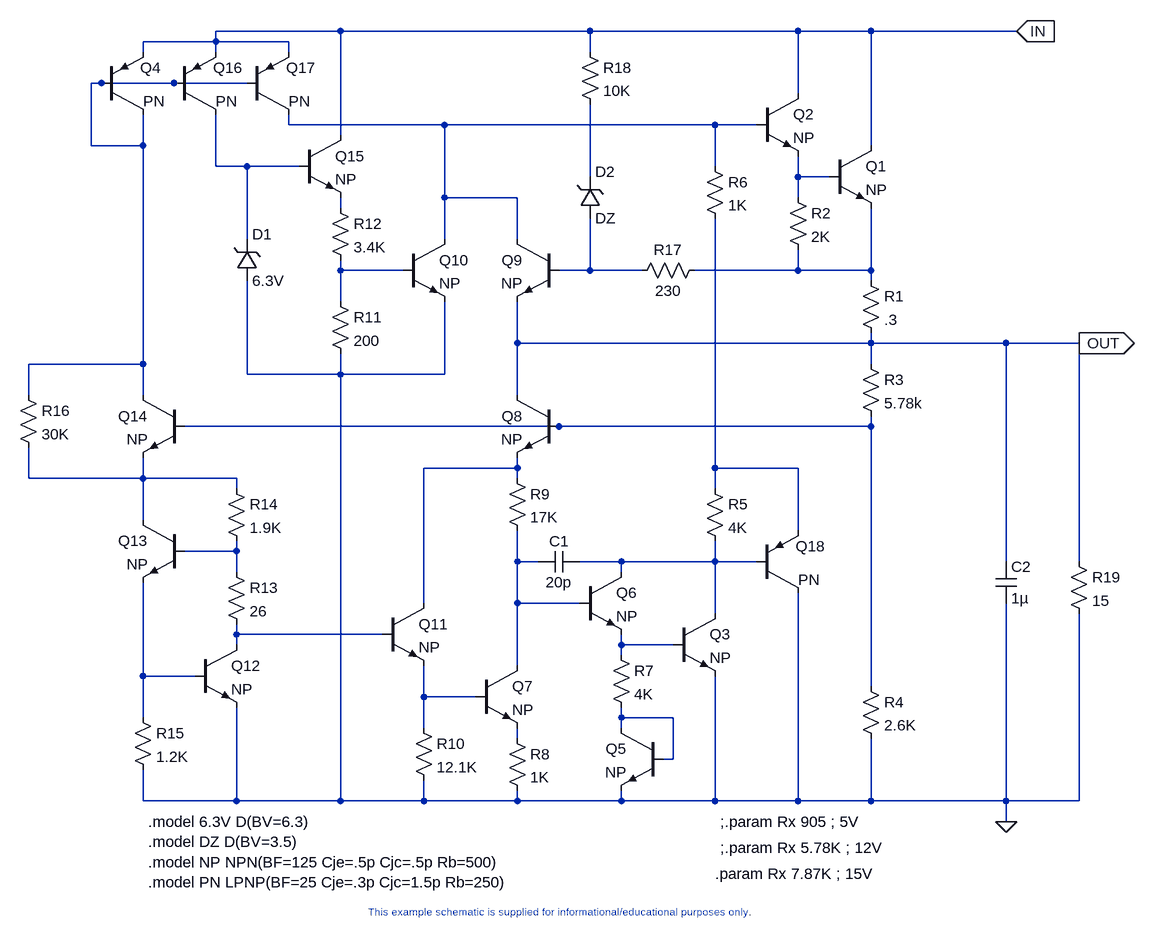
[diagram p0: schematic LM78XX.asc]
LM78XX.asc, the LTspice schematic file:
Version 4
SHEET 1 2428 1688
WIRE 1120 288 928 288
WIRE 1504 288 1120 288
WIRE 1824 288 1504 288
WIRE 1936 288 1824 288
WIRE 2160 288 1936 288
WIRE 928 304 928 288
WIRE 928 304 816 304
WIRE 1040 304 928 304
WIRE 816 320 816 304
WIRE 928 320 928 304
WIRE 1040 320 1040 304
WIRE 1504 320 1504 288
WIRE 752 368 736 368
WIRE 864 368 752 368
WIRE 976 368 864 368
WIRE 1824 384 1824 288
WIRE 1040 432 1040 416
WIRE 1280 432 1040 432
WIRE 1696 432 1280 432
WIRE 1760 432 1696 432
WIRE 1120 448 1120 288
WIRE 736 464 736 368
WIRE 816 464 816 416
WIRE 816 464 736 464
WIRE 1936 464 1936 288
WIRE 928 496 928 416
WIRE 976 496 928 496
WIRE 1056 496 976 496
WIRE 1696 496 1696 432
WIRE 1504 512 1504 400
WIRE 1824 512 1824 480
WIRE 1872 512 1824 512
WIRE 1280 544 1280 432
WIRE 1392 544 1280 544
WIRE 1824 544 1824 512
WIRE 1120 560 1120 544
WIRE 976 608 976 496
WIRE 1280 608 1280 544
WIRE 1392 608 1392 544
WIRE 1120 656 1120 640
WIRE 1216 656 1120 656
WIRE 1504 656 1504 576
WIRE 1504 656 1456 656
WIRE 1584 656 1504 656
WIRE 1824 656 1824 624
WIRE 1824 656 1664 656
WIRE 1936 656 1936 560
WIRE 1936 656 1824 656
WIRE 1936 672 1936 656
WIRE 1120 704 1120 656
WIRE 1392 768 1392 704
WIRE 1936 768 1936 752
WIRE 1936 768 1392 768
WIRE 2144 768 1936 768
WIRE 2256 768 2144 768
WIRE 816 800 816 464
WIRE 816 800 640 800
WIRE 1936 800 1936 768
WIRE 976 816 976 672
WIRE 1120 816 1120 784
WIRE 1120 816 976 816
WIRE 1280 816 1280 704
WIRE 1280 816 1120 816
WIRE 640 848 640 800
WIRE 816 848 816 800
WIRE 1392 848 1392 768
WIRE 1456 896 880 896
WIRE 1936 896 1936 880
WIRE 1936 896 1456 896
WIRE 1392 960 1392 944
WIRE 1392 960 1248 960
WIRE 1696 960 1696 576
WIRE 1824 960 1696 960
WIRE 640 976 640 928
WIRE 816 976 816 944
WIRE 816 976 640 976
WIRE 960 976 816 976
WIRE 1392 976 1392 960
WIRE 960 992 960 976
WIRE 1696 992 1696 960
WIRE 816 1040 816 976
WIRE 1824 1056 1824 960
WIRE 960 1088 960 1072
WIRE 960 1088 880 1088
WIRE 1392 1104 1392 1056
WIRE 1424 1104 1392 1104
WIRE 1552 1104 1488 1104
WIRE 1696 1104 1696 1072
WIRE 1696 1104 1552 1104
WIRE 1760 1104 1696 1104
WIRE 2144 1104 2144 768
WIRE 2256 1104 2256 768
WIRE 960 1120 960 1088
WIRE 1552 1120 1552 1104
WIRE 1248 1168 1248 960
WIRE 1392 1168 1392 1104
WIRE 1488 1168 1392 1168
WIRE 1696 1184 1696 1104
WIRE 960 1216 960 1200
WIRE 1184 1216 960 1216
WIRE 960 1232 960 1216
WIRE 1552 1232 1552 1216
WIRE 1632 1232 1552 1232
WIRE 1552 1248 1552 1232
WIRE 1392 1264 1392 1168
WIRE 816 1280 816 1136
WIRE 896 1280 816 1280
WIRE 1936 1296 1936 896
WIRE 1248 1312 1248 1264
WIRE 1328 1312 1248 1312
WIRE 816 1344 816 1280
WIRE 1552 1344 1552 1328
WIRE 1632 1344 1552 1344
WIRE 1248 1360 1248 1312
WIRE 1552 1360 1552 1344
WIRE 1392 1376 1392 1360
WIRE 1632 1408 1632 1344
WIRE 1632 1408 1616 1408
WIRE 816 1472 816 1424
WIRE 960 1472 960 1328
WIRE 960 1472 816 1472
WIRE 1120 1472 1120 816
WIRE 1120 1472 960 1472
WIRE 1248 1472 1248 1440
WIRE 1248 1472 1120 1472
WIRE 1392 1472 1392 1456
WIRE 1392 1472 1248 1472
WIRE 1552 1472 1552 1456
WIRE 1552 1472 1392 1472
WIRE 1696 1472 1696 1280
WIRE 1696 1472 1552 1472
WIRE 1824 1472 1824 1152
WIRE 1824 1472 1696 1472
WIRE 1936 1472 1936 1376
WIRE 1936 1472 1824 1472
WIRE 2144 1472 2144 1168
WIRE 2144 1472 1936 1472
WIRE 2256 1472 2256 1184
WIRE 2256 1472 2144 1472
WIRE 2144 1504 2144 1472
FLAG 2144 1504 0
FLAG 2256 768 OUT
IOPIN 2256 768 Out
FLAG 2160 288 IN
IOPIN 2160 288 In
SYMBOL NPN 1872 464 R0
SYMATTR InstName Q1
SYMATTR Value NP
SYMBOL npn 1760 384 R0
SYMATTR InstName Q2
SYMATTR Value NP
SYMBOL RES 1920 656 R0
SYMATTR InstName R1
SYMATTR Value .3
SYMBOL res 1808 528 R0
SYMATTR InstName R2
SYMATTR Value 2K
SYMBOL res 1920 784 R0
SYMATTR InstName R3
SYMATTR Value 5.78k
SYMBOL res 1920 1280 R0
SYMATTR InstName R4
SYMATTR Value 2.6K
SYMBOL npn 1632 1184 R0
SYMATTR InstName Q3
SYMATTR Value NP
SYMBOL PNP 752 416 M180
WINDOW 0 60 72 Left 2
WINDOW 3 64 20 Left 2
SYMATTR InstName Q4
SYMATTR Value PN
SYMBOL res 1680 976 R0
SYMATTR InstName R5
SYMATTR Value 4K
SYMBOL res 1680 480 R0
SYMATTR InstName R6
SYMATTR Value 1K
SYMBOL npn 1616 1360 M0
SYMATTR InstName Q5
SYMATTR Value NP
SYMBOL res 1536 1232 R0
SYMATTR InstName R7
SYMATTR Value 4K
SYMBOL npn 1488 1120 R0
SYMATTR InstName Q6
SYMATTR Value NP
SYMBOL cap 1488 1088 R90
WINDOW 0 0 32 VBottom 2
WINDOW 3 32 32 VTop 2
SYMATTR InstName C1
SYMATTR Value 20p
SYMBOL npn 1328 1264 R0
SYMATTR InstName Q7
SYMATTR Value NP
SYMBOL res 1376 1360 R0
SYMATTR InstName R8
SYMATTR Value 1K
SYMBOL res 1376 960 R0
SYMATTR InstName R9
SYMATTR Value 17K
SYMBOL npn 1456 848 M0
SYMATTR InstName Q8
SYMATTR Value NP
SYMBOL npn 1456 608 M0
SYMATTR InstName Q9
SYMATTR Value NP
SYMBOL npn 1216 608 R0
SYMATTR InstName Q10
SYMATTR Value NP
SYMBOL npn 1184 1168 R0
SYMATTR InstName Q11
SYMATTR Value NP
SYMBOL res 1232 1344 R0
SYMATTR InstName R10
SYMATTR Value 12.1K
SYMBOL res 1104 688 R0
SYMATTR InstName R11
SYMATTR Value 200
SYMBOL res 1104 544 R0
SYMATTR InstName R12
SYMATTR Value 3.4K
SYMBOL npn 896 1232 R0
SYMATTR InstName Q12
SYMATTR Value NP
SYMBOL res 944 1104 R0
SYMATTR InstName R13
SYMATTR Value 26
SYMBOL res 944 976 R0
SYMATTR InstName R14
SYMATTR Value 1.9K
SYMBOL npn 880 1040 M0
SYMATTR InstName Q13
SYMATTR Value NP
SYMBOL res 800 1328 R0
SYMATTR InstName R15
SYMATTR Value 1.2K
SYMBOL npn 880 848 M0
SYMATTR InstName Q14
SYMATTR Value NP
SYMBOL res 624 832 R0
SYMATTR InstName R16
SYMATTR Value 30K
SYMBOL npn 1056 448 R0
SYMATTR InstName Q15
SYMATTR Value NP
SYMBOL zener 960 672 M180
WINDOW 0 24 72 Left 2
WINDOW 3 24 0 Left 2
SYMATTR InstName D1
SYMATTR Value 6.3V
SYMBOL res 1680 640 R90
WINDOW 0 0 56 VBottom 2
WINDOW 3 32 56 VTop 2
SYMATTR InstName R17
SYMATTR Value 230
SYMBOL zener 1488 576 M180
WINDOW 0 24 72 Left 2
WINDOW 3 24 0 Left 2
SYMATTR InstName D2
SYMATTR Value DZ
SYMBOL res 1488 304 R0
SYMATTR InstName R18
SYMATTR Value 10K
SYMBOL pnp 864 416 M180
WINDOW 0 60 72 Left 2
WINDOW 3 64 20 Left 2
SYMATTR InstName Q16
SYMATTR Value PN
SYMBOL pnp 976 416 M180
WINDOW 0 60 72 Left 2
WINDOW 3 64 20 Left 2
SYMATTR InstName Q17
SYMATTR Value PN
SYMBOL cap 2128 1104 R0
SYMATTR InstName C2
SYMATTR Value 1µ
SYMBOL res 2240 1088 R0
SYMATTR InstName R19
SYMATTR Value 15
SYMBOL pnp 1760 1152 M180
WINDOW 0 60 72 Left 2
WINDOW 3 64 20 Left 2
SYMATTR InstName Q18
SYMATTR Value PN
TEXT 824 1504 Left 2 !.model 6.3V D(BV=6.3)\n.model DZ D(BV=3.5)\n.model NP NPN(BF=125 Cje=.5p Cjc=.5p Rb=500)\n.model PN LPNP(BF=25 Cje=.3p Cjc=1.5p Rb=250)
TEXT 1704 1504 Left 2 !;.param Rx 905 ; 5V
TEXT 1704 1544 Left 2 !;.param Rx 5.78K ; 12V
TEXT 1696 1584 Left 2 !.param Rx 7.87K ; 15V
TEXT 1448 1632 Top 1 ;This example schematic is supplied for informational/educational purposes only.

The netlist it stands for:
* LM78XX.asc
Q1 IN N005 N009 0 NP
Q2 IN N002 N005 0 NP
R1 N009 OUT .3
R2 N005 N009 2K
R3 OUT N010 5.78k
R4 N010 0 2.6K
Q3 N016 N018 0 0 NP
Q4 N001 N001 IN 0 PN
R5 N012 N016 4K
R6 N002 N012 1K
Q5 N021 N021 0 0 NP
R7 N018 N021 4K
Q6 N016 N015 N018 0 NP
C1 N016 N015 20p
Q7 N015 N020 N022 0 NP
R8 N022 0 1K
R9 N011 N015 17K
Q8 OUT N010 N011 0 NP
Q9 N002 N008 OUT 0 NP
Q10 N002 N007 0 0 NP
Q11 N011 N017 N020 0 NP
R10 N020 0 12.1K
R11 N007 0 200
R12 N006 N007 3.4K
Q12 N017 N019 0 0 NP
R13 N014 N017 26
R14 N013 N014 1.9K
Q13 N013 N014 N019 0 NP
R15 N019 0 1.2K
Q14 N001 N010 N013 0 NP
R16 N001 N013 30K
Q15 IN N003 N006 0 NP
D1 0 N003 6.3V
R17 N009 N008 230
D2 N008 N004 DZ
R18 IN N004 10K
Q16 N003 N001 IN 0 PN
Q17 N002 N001 IN 0 PN
C2 OUT 0 1µ
R19 OUT 0 15
Q18 0 N016 N012 0 PN
.model D D
.lib standard.dio
.model NPN NPN
.model PNP PNP
.lib standard.bjt
.model 6.3V D(BV=6.3)
.model DZ D(BV=3.5)
.model NP NPN(BF=125 Cje=.5p Cjc=.5p Rb=500)
.model PN LPNP(BF=25 Cje=.3p Cjc=1.5p Rb=250)
;.param Rx 905 ; 5V
;.param Rx 5.78K ; 12V
.param Rx 7.87K ; 15V
* This example schematic is supplied for informational/educational purposes only.
.backanno
.end